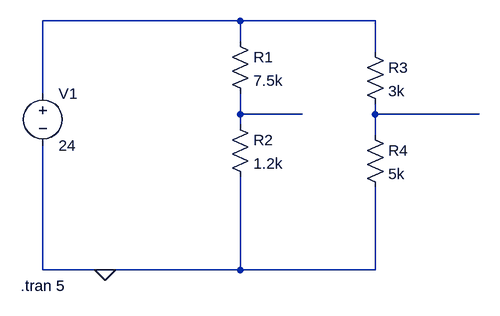
[diagram p0: schematic Draft2.asc]
Draft2.asc, the LTspice schematic file:
Version 4
SHEET 1 880 680
WIRE 400 32 96 32
WIRE 608 32 400 32
WIRE 400 64 400 32
WIRE 608 80 608 32
WIRE 96 144 96 32
WIRE 400 176 400 144
WIRE 496 176 400 176
WIRE 608 176 608 160
WIRE 768 176 608 176
WIRE 400 192 400 176
WIRE 608 208 608 176
WIRE 96 416 96 224
WIRE 192 416 96 416
WIRE 400 416 400 272
WIRE 400 416 192 416
WIRE 608 416 608 288
WIRE 608 416 400 416
FLAG 192 416 0
SYMBOL voltage 96 128 R0
SYMATTR InstName V1
SYMATTR Value 24
SYMBOL res 384 48 R0
SYMATTR InstName R1
SYMATTR Value 7.5k
SYMBOL res 384 176 R0
SYMATTR InstName R2
SYMATTR Value 1.2k
SYMBOL res 592 64 R0
SYMATTR InstName R3
SYMATTR Value 3k
SYMBOL res 592 192 R0
SYMATTR InstName R4
SYMATTR Value 5k
TEXT 62 440 Left 2 !.tran 5

The netlist it stands for:
* Draft2.asc
V1 N001 0 24
R1 N001 N002 7.5k
R2 N002 0 1.2k
R3 N001 N003 3k
R4 N003 0 5k
.tran 5
.backanno
.end